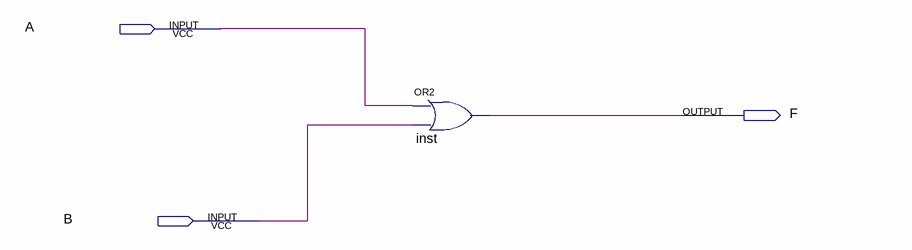
[diagram p0: schematic sheet]
// Quartus schematic orr2.bdf as structural Verilog: 1 symbols, 3 pins
module orr2 (
  input  A,
  input  B,
  output F
);

  or inst (F, A, B);
endmodule
